# Altium schematic sheet CAN.SchDoc
size A4; SheetNumber: 5; SheetTotal: 12
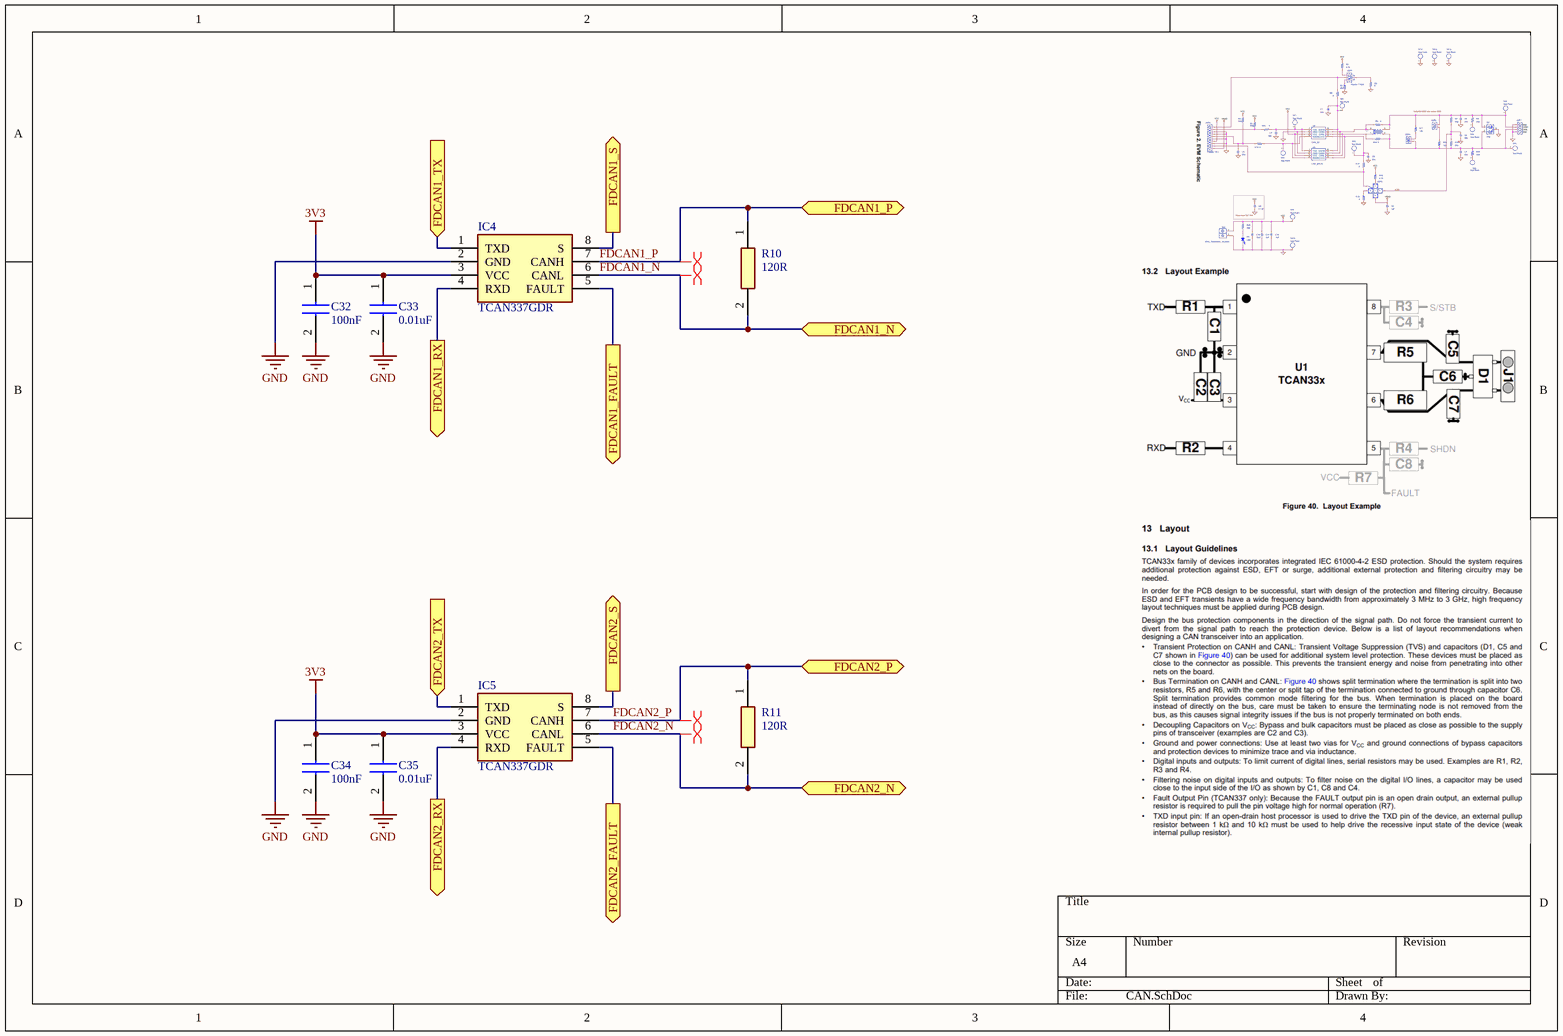
[diagram p0: CAN.SchDoc]

## Parts
C32  100nF  [CAPC1608X95N]
C33  0.01uF  [C0603]
C34  100nF  [CAPC1608X95N]
C35  0.01uF  [C0603]
IC4  TCAN337GDR  [SOIC127P600X175-8N]
IC5  TCAN337GDR  [SOIC127P600X175-8N]
R10  120R  [ERA6VK]
R11  120R  [ERA6VK]

## Ports
FDCAN1_FAULT (out), FDCAN1_N (bidir), FDCAN1_P (bidir), FDCAN1_RX (out), FDCAN1_S (out), FDCAN1_TX (in), FDCAN2_FAULT (out), FDCAN2_N (bidir), FDCAN2_P (bidir), FDCAN2_RX (out), FDCAN2_S (out), FDCAN2_TX (in)

## Nets
3V3: C32.1 C33.1 C34.1 C35.1 IC4.3(VCC) IC5.3(VCC)
GND: C32.2 C33.2 C34.2 C35.2 IC4.2(GND) IC5.2(GND)
FDCAN1_FAULT: IC4.5(FAULT) ; port FDCAN1_FAULT
FDCAN1_N: IC4.6(CANL) R10.2 ; port FDCAN1_N
FDCAN1_P: IC4.7(CANH) R10.1 ; port FDCAN1_P
FDCAN1_RX: IC4.4(RXD) ; port FDCAN1_RX
FDCAN1_S: IC4.8(S) ; port FDCAN1_S
FDCAN1_TX: IC4.1(TXD) ; port FDCAN1_TX
FDCAN2_FAULT: IC5.5(FAULT) ; port FDCAN2_FAULT
FDCAN2_N: IC5.6(CANL) R11.2 ; port FDCAN2_N
FDCAN2_P: IC5.7(CANH) R11.1 ; port FDCAN2_P
FDCAN2_RX: IC5.4(RXD) ; port FDCAN2_RX
FDCAN2_S: IC5.8(S) ; port FDCAN2_S
FDCAN2_TX: IC5.1(TXD) ; port FDCAN2_TX

## Layout directives
differential pair: FDCAN1_N, FDCAN1_P, FDCAN2_N, FDCAN2_P

## Library data of the parts
C32 C34 = C0603C104M4RAC7867: 0.1 µF ±20% 16V Ceramic Capacitor X7R 0603 (1608 Metric); Manufacturer_Name: KEMET; Datasheet Link: https://www.arrow.com/en/products/c0603c104m4rac7867/kemet-corporation?region=nac; Height: 0.95mm; Manufacturer_Part_Number: C0603C104M4RAC7867; Mouser Part Number: N/A; Mouser Price/Stock: https://www.mouser.co.uk/ProductDetail/KEMET/C0603C104M4RAC7867?qs=nAEW9fCjKd%252BI998RVtZhZQ%3D%3D; Arrow Part Number: C0603C104M4RAC7867; Arrow Price/Stock: https://www.arrow.com/en/products/c0603c104m4rac7867/kemet-corporation?region=europe
C33 C35 = C0603C103KMRECAUTO: 10000 pF ±10% 63V Ceramic Capacitor X7R 0603 (1608 Metric); Manufacturer_Name: KEMET; Datasheet Link: https://content.kemet.com/datasheets/KEM_C1090_X7R_ESD.pdf; Height: 0.87mm; Manufacturer_Part_Number: C0603C103KMRECAUTO; Mouser Part Number: 80-C0603C103KMREAUTO; Mouser Price/Stock: https://www.mouser.co.uk/ProductDetail/KEMET/C0603C103KMRECAUTO?qs=u4fy%2FsgLU9P0r6p3bzZgfw%3D%3D; Arrow Part Number: C0603C103KMRECAUTO; Arrow Price/Stock: https://www.arrow.com/en/products/c0603c103kmrecauto/kemet-corporation?region=nac
IC4 IC5 = TCAN337GDR: 1/1 Transceiver CANbus 8-SOIC; Manufacturer_Name: Texas Instruments; Datasheet Link: http://www.ti.com/lit/gpn/tcan337g; Height: 1.75mm; Manufacturer_Part_Number: TCAN337GDR; Mouser Part Number: 595-TCAN337GDR; Mouser Price/Stock: https://www.mouser.co.uk/ProductDetail/Texas-Instruments/TCAN337GDR?qs=gMfM3zrbS4qJ%252BEWbPaeUtA%3D%3D; Arrow Part Number: TCAN337GDR; Arrow Price/Stock: https://www.arrow.com/en/products/tcan337gdr/texas-instruments?region=nac
R10 R11 = ERA-6VEB1200V: 120 Ohms ±0.1% 0.25W, 1/4W Chip Resistor 0805 (2012 Metric) Anti-Sulfur, Automotive AEC-Q200 Thin Film; Manufacturer_Name: Panasonic; Datasheet Link: http://industrial.panasonic.com/cdbs/www-data/pdf/RDM0000/RDM0000C331.pdf; Height: 0.65mm; Manufacturer_Part_Number: ERA-6VEB1200V; Mouser Part Number: 667-ERA-6VEB1200V; Mouser Price/Stock: https://www.mouser.co.uk/ProductDetail/Panasonic/ERA-6VEB1200V?qs=rI7uf1IzohQDwVDMjI%252BQDA%3D%3D; Arrow Part Number: ERA-6VEB1200V; Arrow Price/Stock: https://www.arrow.com/en/products/era-6veb1200v/panasonic?region=nac